# EAGLE design Test (EAGLE 8.7.0)
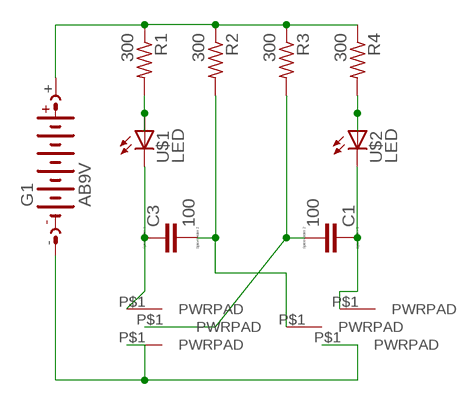
[diagram p0: schematic, sheet 1]

## Parts
C1  100  CC1206  [C1206]
C3  100  CC1206  [C1206]
G1  AB9V  [AB9V]
J1  PWRPAD2-5MM  [PWRPAD_2-5MM]
J2  PWRPAD2-5MM  [PWRPAD_2-5MM]
J3  PWRPAD2-5MM  [PWRPAD_2-5MM]
J4  PWRPAD2-5MM  [PWRPAD_2-5MM]
J5  PWRPAD2-5MM  [PWRPAD_2-5MM]
J6  PWRPAD2-5MM  [PWRPAD_2-5MM]
R1  300  RES-US1206  [R1206]
R2  300  RES-US1206  [R1206]
R3  300  RES-US1206  [R1206]
R4  300  RES-US1206  [R1206]
U$1  LED  [LED1206]
U$2  LED  [LED1206]

## Nets
N$1: G1.+ R1.1 R2.1 R3.1 R4.1
N$2: R1.2 U$1.1(A)
N$3: C3.1 J3.P$1(PWRPAD) U$1.2(C)
N$4: C1.2 J2.P$1(PWRPAD) R3.2
N$5: C3.2 J4.P$1(PWRPAD) R2.2
N$6: R4.2 U$2.1(A)
N$7: C1.1 J5.P$1(PWRPAD) U$2.2(C)
N$8: G1.- J1.P$1(PWRPAD) J6.P$1(PWRPAD)

## Library data of the parts
C1 C3 = eagle-ltspice:C: CAPACITOR, European symbol; SPICEMODEL: NONE; SPICEPREFIX: C
G1 = battery:AB9V: 9-V BATTERY CLIP
J1-J6 = fab:PWRPAD
R1-R4 = fab:RES-US: Resistor (US Symbol) Variants with postfix FAB are widened to allow the routing of internal traces
U$1 U$2 = fab:LED: LED

## Board
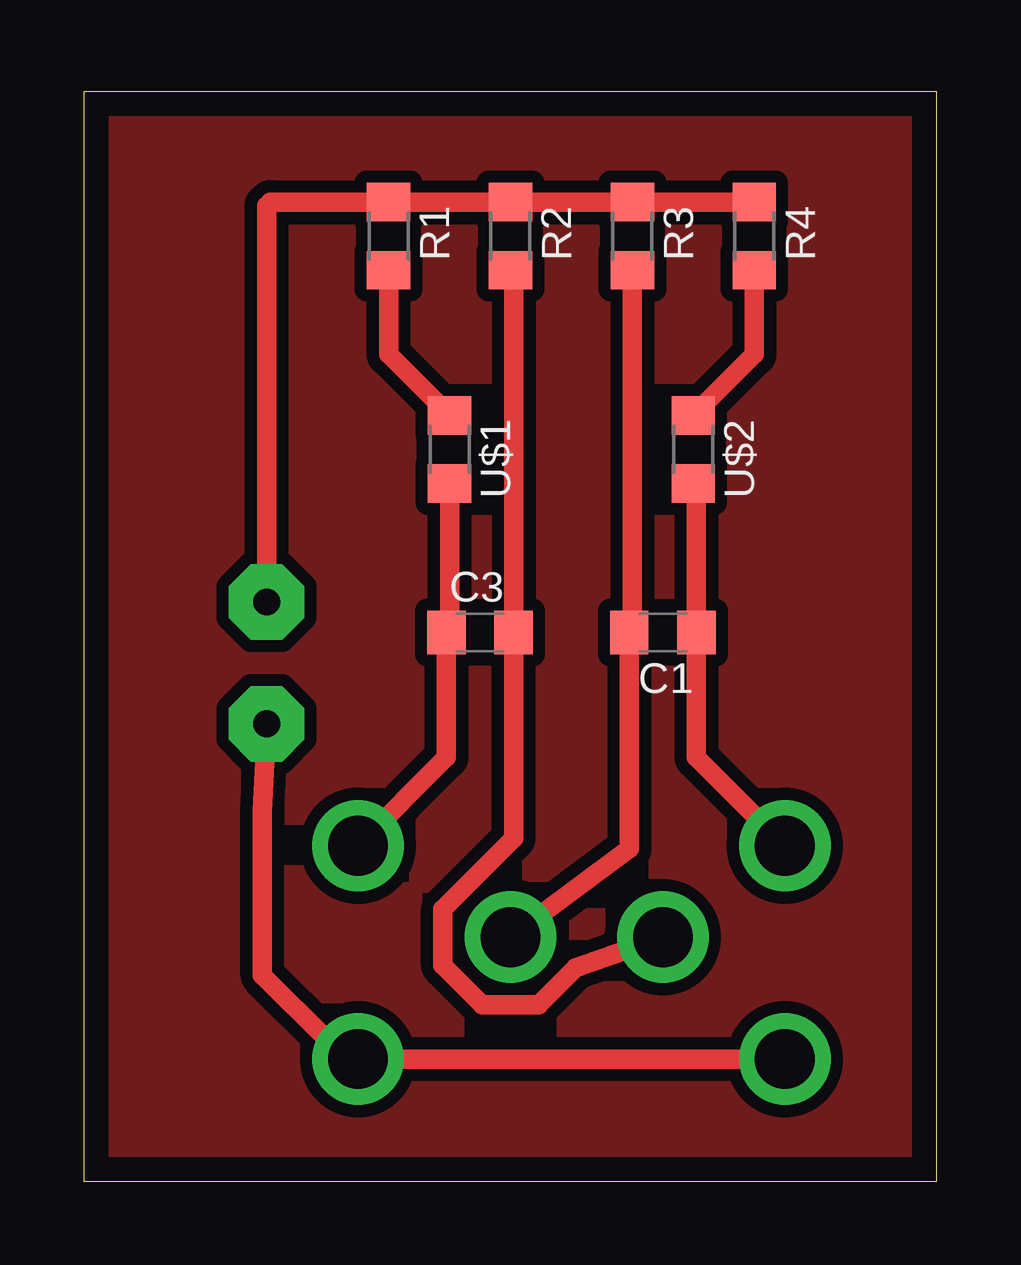
[diagram p1: board, top side]
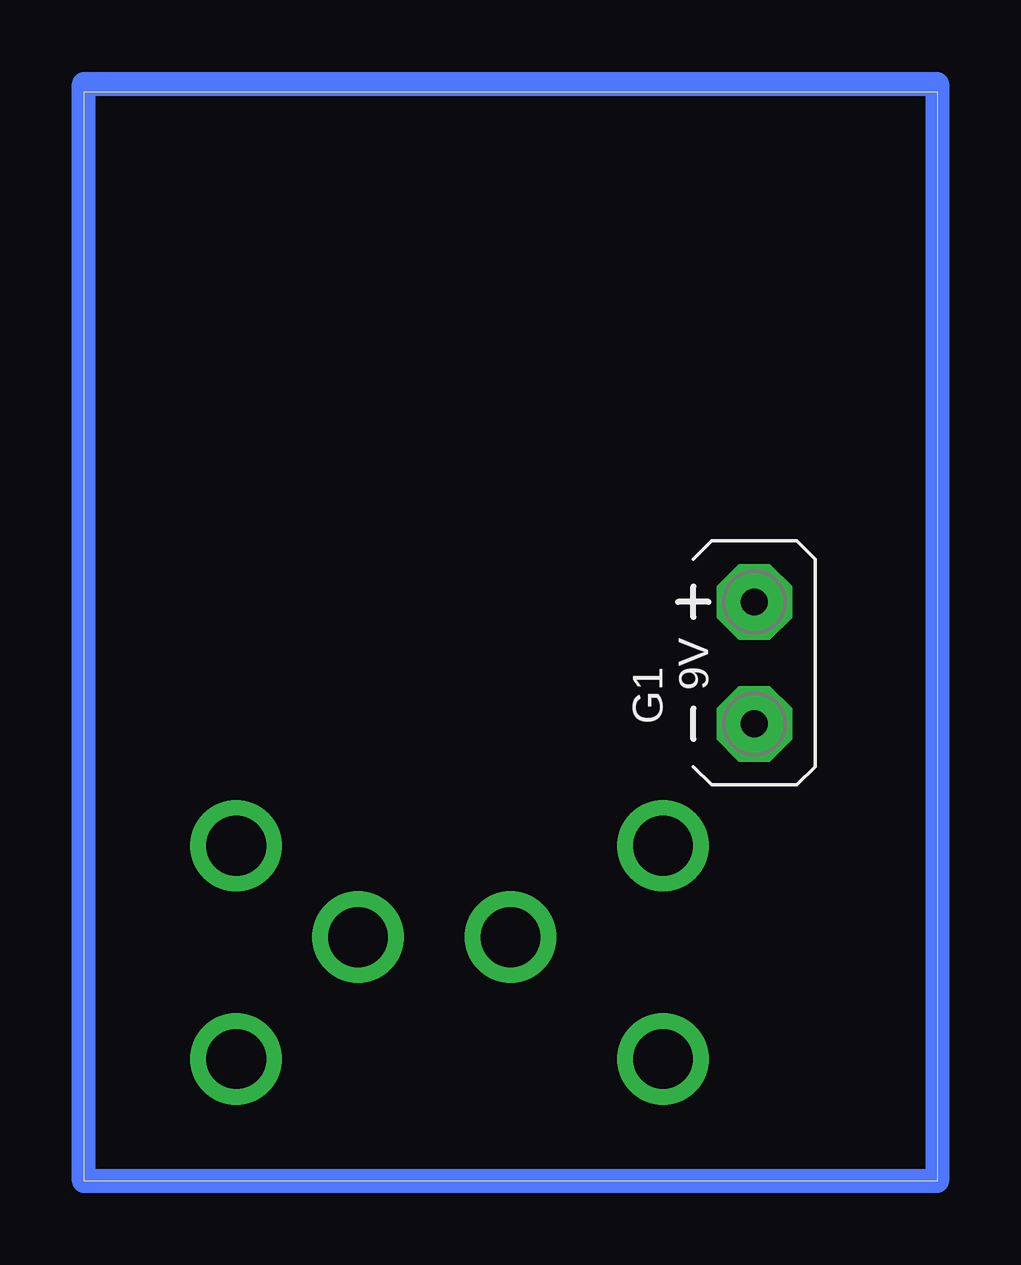
[diagram p2: board, bottom side, seen from below]

Size 35.54 x 45.39 mm. Coordinates in mm from the lower left corner, seen from the top.
Outline: 0,0 35.54,0 35.54,45.39 0,45.39 0,0
Copper layers (1*16): Top 0.035mm / dielectric 1.5mm / Bottom 0.035mm
Design rules "default *": minimum track width 16mil, minimum drill 0.35mm, track to track 20mil, track to pad 20mil, pad to pad 20mil, via to via 20mil, smd to smd 20mil, copper to edge 40mil, drill to drill 6mil, minimum pad ring 10mil, minimum via ring 8mil, stop-mask expansion 4mil, vias tented up to drill 0mil, thermal gap 16mil

### Footprints (pad centres in the part's own frame; a part is rotated, then mirrored left to right if it is on the bottom)
C1206 = smd 1.6 x 1.8: 1 -1.4,0; 2 1.4,0
AB9V = drill 1.118 pad 3.15 octagon: + 0,2.54; - 0,-2.54
PWRPAD_2-5MM = drill 2.489 pad 3.81: P$1 0,0
R1206 = smd 1.6 x 1.803: 1 -1.422,0; 2 1.422,0
LED1206 = smd 1.6 x 1.803: 1 -1.422,0; 2 1.422,0

### Placement (x,y rotation side)
C1  24.13,22.86 180 top
C3  16.51,22.86 0 top
G1  7.62,21.59 0 bottom
J1  11.43,5.08 0 top
J2  17.78,10.16 0 top
J3  11.43,13.97 0 top
J4  24.13,10.16 0 top
J5  29.21,13.97 0 top
J6  29.21,5.08 0 top
R1  12.7,39.37 270 top
R2  17.78,39.37 270 top
R3  22.86,39.37 270 top
R4  27.94,39.37 270 top
U$1  15.24,30.48 270 top
U$2  25.4,30.48 270 top

### Tracks (layer width: path | path; a pad name or v marks a point on that pad's centre or on a via)
N$1
  Top 0.813: G1.+ 7.62,40.64 7.77,40.79 R1.1 R2.1 R3.1 R4.1
N$2
  Top 0.813: U$1.1 12.7,34.44 R1.2
N$3
  Top 0.813: U$1.2 15.24,22.99 C3.1 15.11,17.65 J3.P$1
N$4
  Top 0.813: R3.2 22.86,22.99 C1.2 22.73,13.84 J2.P$1
N$5
  Top 0.813: R2.2 17.91,37.82 C3.2 17.91,14.28 14.96,11.33 14.96,8.99 16.61,7.34 18.95,7.34 20.5,8.89 J4.P$1
N$6
  Top 0.813: R4.2 27.94,34.44 U$2.1
N$7
  Top 0.813: J5.P$1 25.53,17.65 C1.1 25.53,28.93 U$2.2
N$8
  Top 0.813: J6.P$1 J1.P$1 10.16,5.86 7.44,8.58 7.44,15.42 G1.-
N$9
  pour Top: 0,45.72 0,0 35.56,0 35.56,45.72
N$10
  Bottom 0.99: 0,45.72 0,0 35.56,0 35.56,45.72 0,45.72